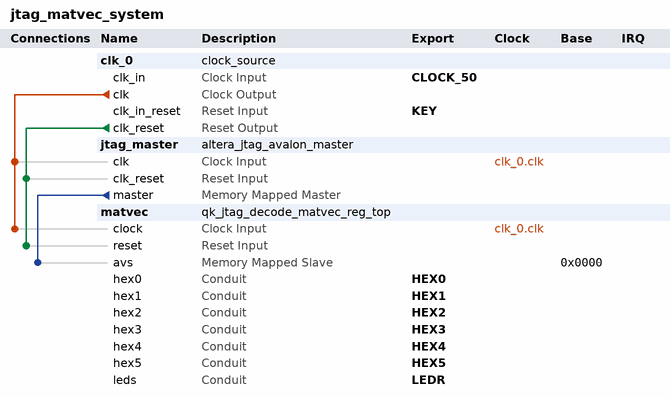
[diagram p0: system contents]
# Platform Designer (Qsys) system jtag_matvec_system, MAX 10 10M50DAF484C7G
# Parameters at their usual value, and those the tool derives, are not listed.
package require -exact qsys 25.1
create_system jtag_matvec_system
set_project_property DEVICE_FAMILY {MAX 10}
set_project_property DEVICE 10M50DAF484C7G

add_instance clk_0 clock_source 25.1
set_instance_parameter_value clk_0 clockFrequency 50000000

add_instance jtag_master altera_jtag_avalon_master 25.1

add_instance matvec qk_jtag_decode_matvec_reg_top 0.1

# connections
add_connection clk_0.clk jtag_master.clk clock
add_connection clk_0.clk matvec.clock clock
add_connection clk_0.clk_reset jtag_master.clk_reset reset
add_connection clk_0.clk_reset matvec.reset reset
add_connection jtag_master.master matvec.avs avalon
set_connection_parameter_value jtag_master.master/matvec.avs baseAddress 0x0000

# exported interfaces
add_interface CLOCK_50 clock sink
set_interface_property CLOCK_50 EXPORT_OF clk_0.clk_in
add_interface HEX0 conduit end
set_interface_property HEX0 EXPORT_OF matvec.hex0
add_interface HEX1 conduit end
set_interface_property HEX1 EXPORT_OF matvec.hex1
add_interface HEX2 conduit end
set_interface_property HEX2 EXPORT_OF matvec.hex2
add_interface HEX3 conduit end
set_interface_property HEX3 EXPORT_OF matvec.hex3
add_interface HEX4 conduit end
set_interface_property HEX4 EXPORT_OF matvec.hex4
add_interface HEX5 conduit end
set_interface_property HEX5 EXPORT_OF matvec.hex5
add_interface KEY reset sink
set_interface_property KEY EXPORT_OF clk_0.clk_in_reset
add_interface LEDR conduit end
set_interface_property LEDR EXPORT_OF matvec.leds

set_interconnect_requirement {$system} qsys_mm.clockCrossingAdapter HANDSHAKE
set_interconnect_requirement {$system} qsys_mm.enableEccProtection FALSE
set_interconnect_requirement {$system} qsys_mm.insertDefaultSlave FALSE
set_interconnect_requirement {$system} qsys_mm.maxAdditionalLatency 1

save_system jtag_matvec_system.qsys
